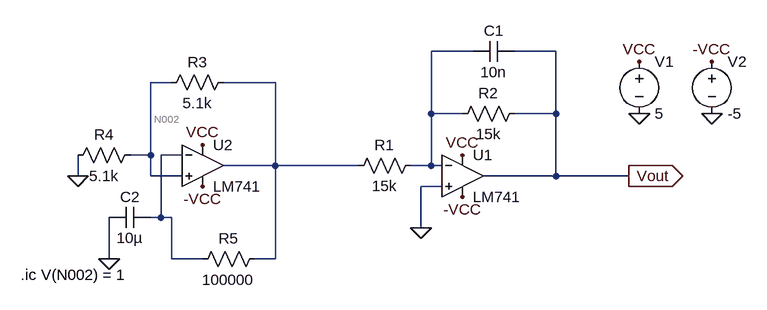
[diagram p0: schematic Lab7_1.asc]
Lab7_1.asc, the LTspice schematic file:
Version 4.1
SHEET 1 880 680
WIRE 176 -32 112 -32
WIRE 304 -32 240 -32
WIRE -288 16 -320 16
WIRE -128 16 -208 16
WIRE 112 64 112 -32
WIRE 160 64 112 64
WIRE 304 64 304 -32
WIRE 304 64 240 64
WIRE -320 128 -320 16
WIRE -320 128 -352 128
WIRE -272 128 -304 128
WIRE -128 144 -128 16
WIRE -128 144 -208 144
WIRE 0 144 -128 144
WIRE 112 144 112 64
WIRE 112 144 80 144
WIRE 128 144 112 144
WIRE -432 160 -432 128
WIRE -320 160 -320 128
WIRE -272 160 -320 160
WIRE 304 160 304 64
WIRE 304 160 192 160
WIRE 416 160 304 160
WIRE 128 176 96 176
WIRE -304 224 -304 128
WIRE -304 224 -320 224
WIRE -288 224 -304 224
WIRE 96 240 96 176
WIRE -384 288 -384 224
WIRE -288 288 -288 224
WIRE -240 288 -288 288
WIRE -128 288 -128 144
WIRE -128 288 -160 288
FLAG 96 240 0
FLAG 432 64 0
FLAG 544 64 0
FLAG 432 -16 VCC
FLAG 160 128 VCC
FLAG 544 -16 -VCC
FLAG 160 192 -VCC
FLAG 416 160 Vout
IOPIN 416 160 Out
FLAG -240 176 -VCC
FLAG -240 112 VCC
FLAG -384 288 0
FLAG -432 160 0
SYMBOL res 96 128 R90
WINDOW 0 0 56 VBottom 2
WINDOW 3 32 56 VTop 2
SYMATTR InstName R1
SYMATTR Value 15k
SYMBOL res 256 48 R90
WINDOW 0 0 56 VBottom 2
WINDOW 3 32 56 VTop 2
SYMATTR InstName R2
SYMATTR Value 15k
SYMBOL cap 240 -48 R90
WINDOW 0 0 32 VBottom 2
WINDOW 3 32 32 VTop 2
SYMATTR InstName C1
SYMATTR Value 10n
SYMBOL voltage 432 -32 R0
SYMATTR InstName V1
SYMATTR Value 5
SYMBOL voltage 544 -32 R0
SYMATTR InstName V2
SYMATTR Value -5
SYMBOL res -192 0 R90
WINDOW 0 0 56 VBottom 2
WINDOW 3 32 56 VTop 2
SYMATTR InstName R3
SYMATTR Value 5.1k
SYMBOL res -336 112 R90
WINDOW 0 0 56 VBottom 2
WINDOW 3 32 56 VTop 2
SYMATTR InstName R4
SYMATTR Value 5.1k
SYMBOL cap -320 208 R90
WINDOW 0 0 32 VBottom 2
WINDOW 3 32 32 VTop 2
SYMATTR InstName C2
SYMATTR Value 10µ
SYMBOL res -144 272 R90
WINDOW 0 0 56 VBottom 2
WINDOW 3 32 56 VTop 2
SYMATTR InstName R5
SYMATTR Value 100000
SYMBOL LM741 -240 80 R0
SYMATTR InstName U2
SYMBOL LM741 160 96 R0
SYMATTR InstName U1
TEXT -520 312 Left 2 !.ic V(N002) = 1

The netlist it stands for:
* Lab7_1.asc
R1 N001 N003 15k
R2 Vout N001 15k
C1 Vout N001 10n
V1 VCC 0 5
V2 -VCC 0 -5
R3 N003 N002 5.1k
R4 N002 0 5.1k
C2 N004 0 10µ
R5 N003 N004 100000
X§U2 N002 N004 VCC -VCC N003 LM741  ; pins In+ In- V+ V- OUT
X§U1 0 N001 VCC -VCC Vout LM741  ; pins In+ In- V+ V- OUT
.ic V(N002) = 1
.lib LM741.lib
.backanno
.end